# Altium project nguonLM7805.PrjPCB
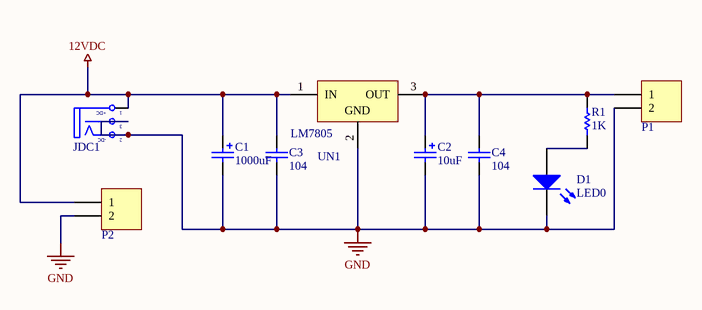
[diagram p0: lm7805.SchDoc]
1 sheet, 10 parts. Net scope: global (net labels, ports and power ports of the same name join across sheets).
Board file: lm7805.PcbDoc

## Sheet lm7805.SchDoc
size A

### Parts
C1  value 1000uF  [CP1/2]  (hidden comment: Cap Pol)
C2  value 10uF  [CP1/2]  (hidden comment: Cap Pol)
C3  value 104  [CN1]  (hidden comment: Cap Non-Pol)
C4  value 104  [CN1]  (hidden comment: Cap Non-Pol)
D1  LED0  [LED-0]
JDC1  Jack DC  [DC-IN]  (value not drawn)
P1  Header 2  [JP2]  (value not drawn)
P2  Domino 2  [DOMINO 2- 5mm]  (value not drawn)
R1  value 1K  [RES 1/2W]  (hidden comment: RESISTOR)
UN1  LM7805  [QTO-220]

### Nets
12VDC: C1.1 C3.2 JDC1.1(T) P2.1 UN1.1(IN)
GND: C1.2 C2.2 C3.1 C4.1 D1.2(K) JDC1.2(TN) JDC1.3(S) P1.2 P2.2 UN1.2(GND)
NetC2_1: C2.1 C4.2 P1.1 R1.2 UN1.3(OUT)
NetD1_1: D1.1(A) R1.1

### Notes on the sheet
- (in symbol Jack DC) +DC; -DC

### Library data of the parts
C1 C2 = Cap Pol: Polarized Capacitor (Radial)
C3 C4 = Cap Non-Pol: Capacitor
D1 = LED0: Typical INFRARED GaAs LED; Published: 8-Jun-2000; LatestRevisionDate: 08-Jul-2005; LatestRevisionNote: Mech Layer 1 removed.; PackageReference: LED-0; Publisher: Altium Limited; PackageDescription: LED; 2 Leads
JDC1 = Jack DC: Jack DC input; Value: Jac DC
P1 = Header 2: Header, 2-Pin; LatestRevisionDate: 17-Jul-2002; LatestRevisionNote: Re-released for DXP Platform.; Publisher: Altium Limited
P2 = Domino 2: Domino, 2-Pin; LatestRevisionDate: 17-Jul-2002; LatestRevisionNote: Re-released for DXP Platform.; Publisher: Altium Limited
UN1 = LM7805: Positive Voltage Regulator